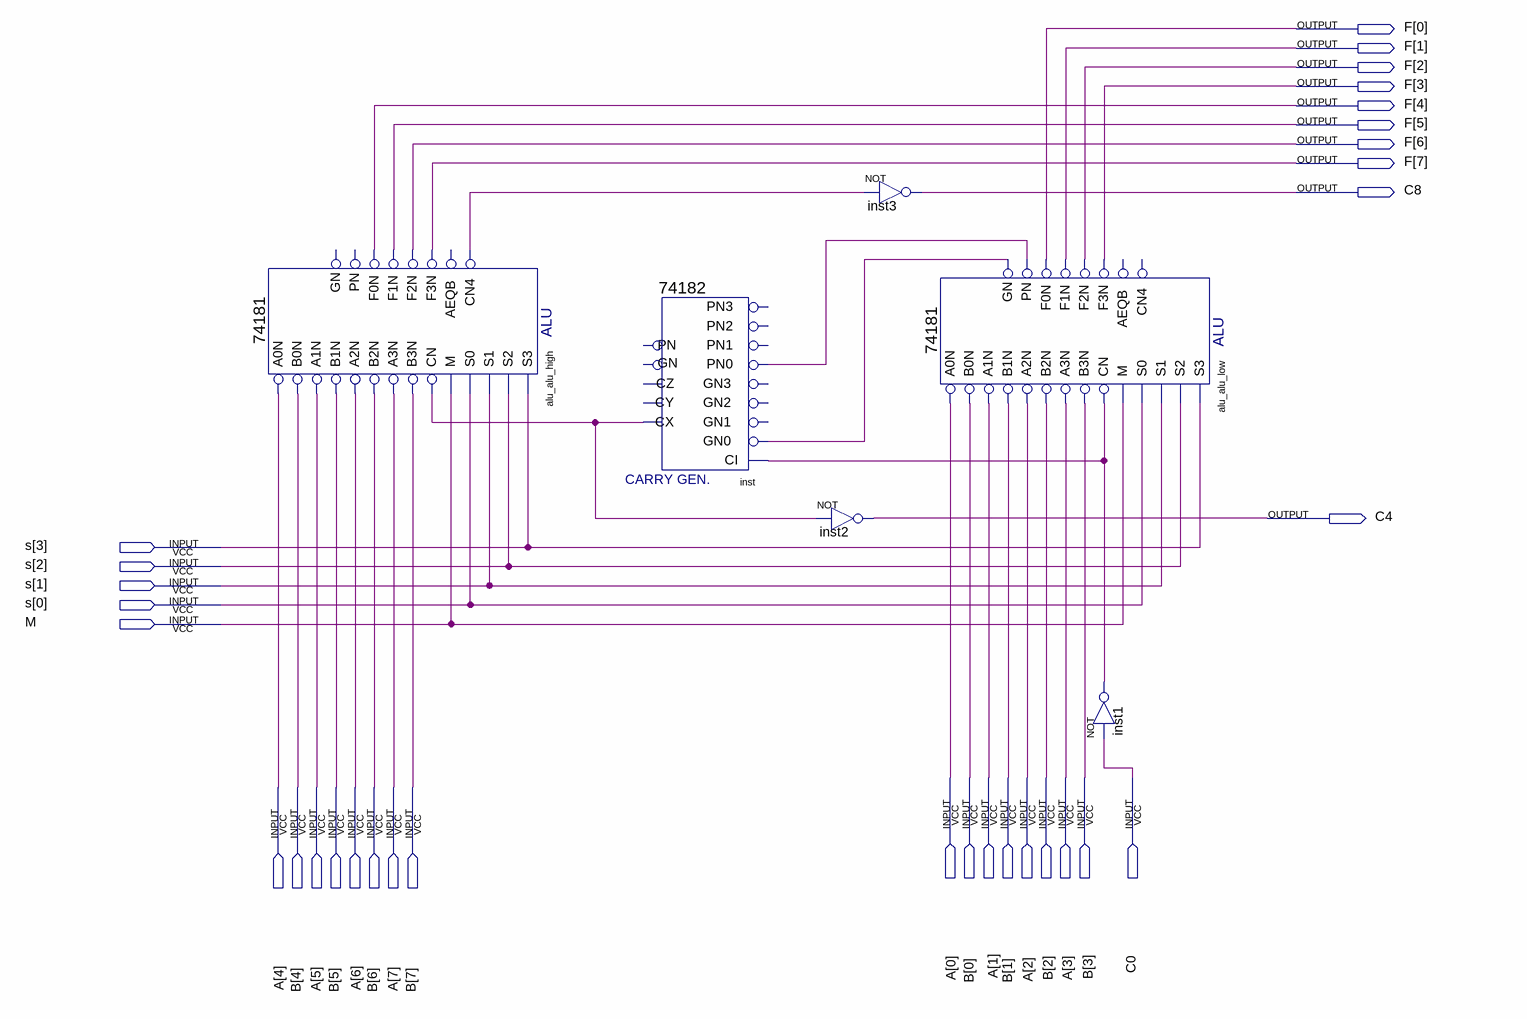
[diagram p0: schematic sheet]
// Quartus schematic alu_chip.bdf as structural Verilog: 6 symbols, 32 pins
module alu_chip (
  input  [3:0] s,
  input  M,
  input  [7:0] A,
  input  [7:0] B,
  input  C0,
  output [7:0] F,
  output C8,
  output C4
);

  wire alu_alu_high_cn4, alu_alu_low_gn, alu_alu_low_pn, inst1_out, inst_cx;

  \74181  alu_alu_high (
    .B0N(B[4]), .A0N(A[4]), .A1N(A[5]), .B1N(B[5]), .A3N(A[7]), .B2N(B[6]), .A2N(A[6]), .M(M), .CN(inst_cx),
    .B3N(B[7]), .S2(s[2]), .S1(s[1]), .S0(s[0]), .S3(s[3]), .F3N(F[7]), .F1N(F[5]), .F0N(F[4]),
    .CN4(alu_alu_high_cn4), .F2N(F[6]));  // open: PN, GN, AEQB
  \74182  inst (
    .CI(inst1_out), .PN0(alu_alu_low_pn), .GN0(alu_alu_low_gn), .CX(inst_cx));  // open: PN2, GN2, GN3, PN3, PN1, GN1, CY, PN, CZ, GN
  not inst2 (C4, inst_cx);
  not inst3 (C8, alu_alu_high_cn4);
  \74181  alu_alu_low (
    .B0N(B[0]), .A0N(A[0]), .A1N(A[1]), .B1N(B[1]), .A3N(A[3]), .B2N(B[2]), .A2N(A[2]), .M(M),
    .CN(inst1_out), .B3N(B[3]), .S2(s[2]), .S1(s[1]), .S0(s[0]), .S3(s[3]), .PN(alu_alu_low_pn),
    .GN(alu_alu_low_gn), .F3N(F[3]), .F1N(F[1]), .F0N(F[0]), .F2N(F[2]));  // open: AEQB, CN4
  not inst1 (inst1_out, C0);
endmodule
